# Altium schematic sheet 06-Power_B.SchDoc
size A
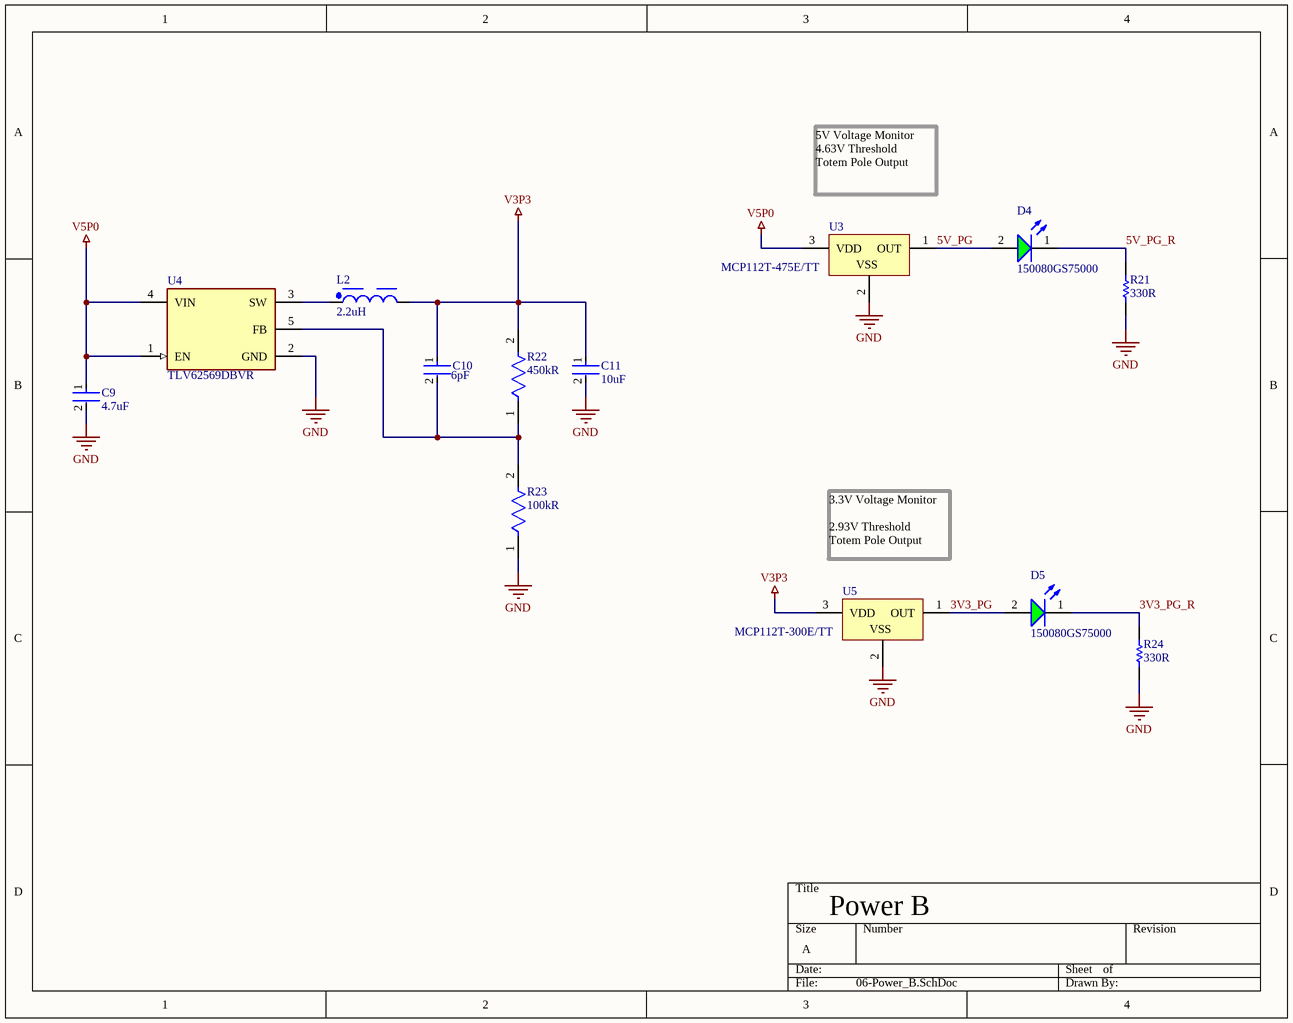
[diagram p0: 06-Power_B.SchDoc]

## Parts
C9  4.7uF  [FP-CC0805-0_85-MFG]
C10  6pF  [FP-CBR08C-MFG]
C11  10uF  [FP-C0805C-DG-MFG]
D4  150080GS75000  [WL-SMCW_0805_150080xx75000]
D5  150080GS75000  [WL-SMCW_0805_150080xx75000]
L2  2.2uH  [WE-TPC_8043]
R21  value 330R  [RESC2013X60X40LL20T25]  (hidden comment: ERA6AEB331V)
R22  450kR  [FP-RT0805-MFG]
R23  100kR  [FP-RMCF0805-IPC_C]
R24  value 330R  [RESC2013X60X40LL20T25]  (hidden comment: ERA6AEB331V)
U3  MCP112T-475E/TT  [SOT-23-TT3_L]
U4  TLV62569DBVR  [FP-DBV0005A-MFG]
U5  MCP112T-300E/TT  [SOT-23-TT3_L]

## Nets
GND: C9.2 C11.2 R21.1 R23.1 R24.1 U3.2(VSS) U4.2(GND) U5.2(VSS)
V3P3: C10.1 C11.1 L2.2 R22.2 U5.3(VDD)
V5P0: C9.1 U3.3(VDD) U4.1(EN) U4.4(VIN)
3V3_PG: D5.2(A) U5.1(OUT)
3V3_PG_R: D5.1(K) R24.2
5V_PG: D4.2(A) U3.1(OUT)
5V_PG_R: D4.1(K) R21.2
NetC10_2: C10.2 R22.1 R23.2 U4.5(FB)
NetL2_1: L2.1 U4.3(SW)

## Notes on the sheet
- 5V Voltage Monitor
  4.63V Threshold
  Totem Pole Output
- 3.3V Voltage Monitor
  2.93V Threshold
  Totem Pole Output
- Power B

## Library data of the parts
C9 = CMP-03422-001026-1: CC0805MKX7R8BB475 / CAP CER 4.7UF 25V X7R 0805; Manufacturer: Yageo; Material: Ceramic; Tolerance: 0.2; Ipc Land Pattern Name: CAPC200125X85; ComponentLink2Description: Datasheet; ComponentLink2URL: http://www.yageo.com/documents/recent/UPY-GPHC_Y5V_6.3V-to-50V_8.pdf; Lead Free: Yes; Mouser Description: Cap Cer 4.7UF 25V X7R 0805; Temperature: -30°C to +85°C; Device Class L3: Ceramic Capacitors; RoHS: TRUE; Height: 0.95mm; Temperature Range Low: -30°C; Device Class L2: Capacitors; Voltage Rating: 25 V; Temperature Characteristic: X7R; Value: 4.7 uF; Category: Cap; Digikey Description: CAP CER 4.7UF 25V X7R 0805; Package: CC0805-0.85; Footprint Url: http://www.yageo.com/exep/pages/download/literatures/UPY-C_GEN_24.pdf; Capacitance: 4.7 uF; Temperature Range High: +85°C; Manufacturer Part Number: CC0805MKX7R8BB475; Device Class L1: Passive Components; Octopart: https://octopart.com/cc0805mkx7r8bb475-yageo-81932647; Automotive: No
C10 = CMP-03020-018446-1: CAP CER 6PF 250V C0G/NP0 0805; Manufacturer Part Number: CBR08C609CAGAC; Manufacturer: KEMET; Temperature Characteristic: C0G; Tolerance: 0.25 pF; Material: Ceramic; Temperature Coefficient: 30ppm/°C; Capacitance: 6.0 pF; Value: 6.0 pF; Lead Free: Yes; Category: Cap; Device Class L3: Ceramic Capacitors; Temperature: -55°C to +125°C; Height: 0.95mm; Package: CBR08C; Temperature Range Low: -55°C; Device Class L1: Passive Components; ComponentLink2Description: Datasheet; ComponentLink2URL: https://content.kemet.com/datasheets/KEM_C1030_CBR_SMD.pdf; Digikey Description: CAP CER 6PF 250V C0G/NP0 0805; Ipc Land Pattern Name: CAPC200125X85; Octopart: https://octopart.com/cbr08c609cagac-kemet-23841672; Device Class L2: Capacitors; Temperature Range High: +125°C; Voltage Rating: 250 V; RoHS: TRUE; Mouser Description: Multilayer Ceramic Capacitors MLCC - SMD/SMT 250volts 6pF C0G 0805 .25pF Tol RF; Automotive: No
C11 = CMP-2007-03243-2: CAP CER 10UF 10V X5R 0805; Manufacturer Part Number: C0805C106K8PACTU; Manufacturer: Kemet; 3DS Part Number: 220-00001; Tolerance: 10%; Temperature Coefficient: 15%; Material: Ceramic; Device Class L2: Capacitors; Device Class L1: Passive Components; ComponentLink2URL: https://content.kemet.com/datasheets/KEM_C1006_X5R_SMD.pdf; Height: 1.4mm; Lead Free: Yes; Digikey Description: CAP CER 10UF 10V X5R 0805; Octopart: https://octopart.com/c0805c106k8pactu-kemet-98697; Capacitance: 10uF; Value: 10uF; Temperature Range Low: -55°C; Temperature: -55°C to +85°C; Automotive: No; Mouser Description: CAP CER 10UF 10V X5R 0805; Ipc Land Pattern Name: CAPC200125X125; Temperature Range High: +85°C; Voltage: 10V; RoHS: TRUE; Device Class L3: Ceramic Capacitors; ComponentLink2Description: Datasheet; Voltage Rating: 10V; Package: C0805C-DG; Temperature Characteristic: X5R; Category: Cap
D4 D5 = CMP-1426-00007-2: LED GREEN CLEAR 0805 SMD; NexarPartId: 29717780; Manufacturer: Wurth Electronics; Wavelength: 520nm; Forward Current: 100mA; Lens Style: Clear, Rectangular; Dominant Wavelength: 525nm; Max Junction Temperature (Tj): 95°C; Power Dissipation: 105mW; Luminous Intensity: 450mcd; Peak Wavelength: 515nm; Viewing Angle: 140°; Test Current: 20mA; Reverse Voltage: 5V; Forward Voltage: 3.2V; Lens Color: Colorless; Lens Size: 1.25mm; Mount: Surface Mount; REACH SVHC: Unknown; Min Operating Temperature: -40°C; Case Code (Imperial): 0805; Case/Package: 0805; Max Operating Temperature: 85°C; RoHS: Compliant; Length: 2mm; Height: 700µm; Width: 1.25mm; Color: Green; Case Code (Metric): 2012; Packaging: Tape and Reel; Max Reverse Voltage (DC): 5V; Supplier: Digikey; Supplier Part Number: 732-4983-1-ND; Manufacturer Part Number: 150080GS75000; Category: LEDs; Stock: 34895; Pricing: 1=0.19, 50=0.176, 100=0.151, 500=0.131 (USD); Mounting Technology: Surface Mount; Package Quantity: 1; Series: WL-SMCW; Lens Transparency: Clear; RoHS Compliant: Yes; Reach SVHC Compliant: Unknown; ComponentLink1URL: https://datasheet.ciiva.com/29563/150080gs75000-29563008.pdf?src-supplier=Digikey; ComponentLink1Description: https://datasheet.ciiva.com/29563/150080gs75000-29563008.pdf?src-supplier=Digikey; ComponentLink2URL: https://datasheet.ciiva.com/29279/759434-da-01-en-chipled-0805-w-kl-gruen-150080gs75000-29279039.pdf?src-supplier=Conrad; ComponentLink2Description: https://datasheet.ciiva.com/29279/759434-da-01-en-chipled-0805-w-kl-gruen-150080gs75000-29279039.pdf?src-supplier=Conrad
L2 = CMP-1479-00021-3: Fixed Ind 2.2UH 5.4A 13 Mohm SMD; NexarPartId: 23392435; Inductance Tolerance: 30%; Self Resonant Frequency: 62MHz; Inductance: 2.2µH; DC Resistance (DCR): 10mΩ; Shielding: Shielded; Series Resistance: 13mΩ; Test Frequency: 100kHz; Saturation Current: 6.3A; Core Material: Ferrite; Packaging: Cut Tape (CT); Width: 8mm; Current Rating: 5.4A; Max Operating Temperature: 125°C; Tolerance: 30%; Number of Pins: 2; Mount: Surface Mount; Termination: SMD/SMT; Min Operating Temperature: -40°C; Lead Free: Lead Free; Ambient Temperature Range High: 85°C; RMS Current (Irms): 5.4A; RoHS: Compliant; Case/Package: Nonstandard; Height: 4.3mm; Composition: Wirewound; REACH SVHC: Unknown; Ambient Temperature Range Low: -40°C; Height - Seated (Max): 4.5974mm; Max DC Current: 5.4A; Length: 8mm
R21 R24 = CMP-2001-00628-1: RES SMD 330 OHM 1% 1/8W 0805; Manufacturer: Panasonic; Manufacturer Part Number: ERJ-6ENF3300V; Voltage Rating: 150V; Power Rating: 125mW; Temperature Coefficient: 100ppm/°C; ComponentLink1URL: https://datasheet.ciiva.com/11808/0900766b80eb1d8c-11808093.pdf?src-supplier=Rs; ComponentLink1Description: https://datasheet.ciiva.com/11808/0900766b80eb1d8c-11808093.pdf?src-supplier=Rs; ComponentLink2URL: https://datasheet.ciiva.com/29184/452857-da-01-en-widerstand-0805-era-29184079.pdf?src-supplier=Conrad; ComponentLink2Description: https://datasheet.ciiva.com/29184/452857-da-01-en-widerstand-0805-era-29184079.pdf?src-supplier=Conrad; ComponentLink3URL: https://datasheet.ciiva.com/9182/aoa0000ce26-9182968.pdf?src-supplier=Avnet; ComponentLink3Description: https://datasheet.ciiva.com/9182/aoa0000ce26-9182968.pdf?src-supplier=Avnet; ComponentLink4URL: https://datasheet.ciiva.com/48536/era-eng-tds-48536857.pdf?src-supplier=Distrelec; ComponentLink4Description: https://datasheet.ciiva.com/48536/era-eng-tds-48536857.pdf?src-supplier=Distrelec; ComponentLink5URL: https://datasheet.ciiva.com/22759/485442-22759176.pdf?src-supplier=Farnell; ComponentLink5Description: https://datasheet.ciiva.com/22759/485442-22759176.pdf?src-supplier=Farnell; ComponentLink6URL: https://datasheet.ciiva.com/6138/485442-6138589.pdf?src-supplier=Farnell; ComponentLink6Description: https://datasheet.ciiva.com/6138/485442-6138589.pdf?src-supplier=Farnell; ComponentLink7URL: https://datasheet.ciiva.com/43457/485442-43457816.pdf?src-supplier=Farnell; ComponentLink7Description: https://datasheet.ciiva.com/43457/485442-43457816.pdf?src-supplier=Farnell; ComponentLink8URL: https://datasheet.ciiva.com/6138/485442-6138585.pdf?src-supplier=Farnell; ComponentLink8Description: https://datasheet.ciiva.com/6138/485442-6138585.pdf?src-supplier=Farnell; ComponentLink9URL: https://datasheet.ciiva.com/24164/aoa0000ce26-197354-24164407.pdf?src-supplier=Mouser; ComponentLink9Description: https://datasheet.ciiva.com/24164/aoa0000ce26-197354-24164407.pdf?src-supplier=Mouser; ComponentLink10URL: https://datasheet.ciiva.com/22744/1776116-22744153.pdf?src-supplier=Element14; ComponentLink10Description: https://datasheet.ciiva.com/22744/1776116-22744153.pdf?src-supplier=Element14; ComponentLink11URL: https://datasheet.ciiva.com/46436/485442-46436606.pdf?src-supplier=Element14; ComponentLink11Description: https://datasheet.ciiva.com/46436/485442-46436606.pdf?src-supplier=Element14; ComponentLink12URL: https://datasheet.ciiva.com/16777/70068849-16777611.pdf?src-supplier=Allied+Electronics; ComponentLink12Description: https://datasheet.ciiva.com/16777/70068849-16777611.pdf?src-supplier=Allied+Electronics; ComponentLink13URL: https://datasheet.ciiva.com/30237/54aoa0000ce26-30237450.pdf?src-supplier=Onlinecomponents.com; ComponentLink13Description: https://datasheet.ciiva.com/30237/54aoa0000ce26-30237450.pdf?src-supplier=Onlinecomponents.com; Supplier: Digikey; Supplier Part Number: P330CCT-ND; RoHS: Yes; Category: Chip SMD Resistors; Stock: 40201; Pricing: 1=0.11, 10=0.053, 50=0.0344, 100=0.0292, 500=0.02058, 1000=0.01792 (USD); Mounting Technology: Surface Mount; Case/Package: 0805; Pins: 2; Case Code (Imperial): 0805; Case Code (Metric): 2012; Contact Plating: Tin; Min Operating Temperature: -55°C; Max Operating Temperature: 155°C; Packaging: Tape and Reel; Tolerance: 1%; Package Quantity: 1; Resistor Type: Thick Film; Number of Terminations: 2; Termination: SMD/SMT; Max Power Dissipation: 125mW; Series: ERJ; Resistance Tolerance: 1%; Technology: THICK FILM; Construction: Rectangular; Voltage Rating (DC): 150V; Features: Automotive AEC-Q200; Length: 2mm; Width: 1.2mm; Height: 0.6mm; Depth: 1.25mm; Reach SVHC Compliant: No; Military Standard: Not; RoHS Compliant: Yes; ComponentLink14URL: https://datasheet.ciiva.com/11821/0900766b80f80784-11821635.pdf?src-supplier=Rs; ComponentLink14Description: https://datasheet.ciiva.com/11821/0900766b80f80784-11821635.pdf?src-supplier=Rs; ComponentLink15URL: https://datasheet.ciiva.com/24025/aoa0000ce2-24025991.pdf?src-supplier=Mouser; ComponentLink15Description: https://datasheet.ciiva.com/24025/aoa0000ce2-24025991.pdf?src-supplier=Mouser
R22 = CMP-03412-016799-1: RES SMD 453K OHM 0.1% 1/8W 0805; Manufacturer Part Number: RT0805BRD07453KL; Manufacturer: Yageo; Value: 453KΩ; Tolerance: 0.0025; Temperature Coefficient: 25 ppm/°C; Voltage Rating: 150V; Power Rating: 0.125W; Footprint Url: http://www.yageo.com/exep/pages/download/literatures/PYu-R_Mount_10.pdf; Temperature: -55°C to +155°C; Digikey Description: RES SMD 453K OHM 0.1% 1/8W 0805; Composition: Thin Film; ComponentLink2Description: Datasheet; Device Class L3: Chip SMD Resistors; Ipc Land Pattern Name: RESC200125X50; RoHS: TRUE; Category: Res; ComponentLink2URL: http://www.yageo.com/documents/recent/PYu-RT_1-to-0.01_RoHS_L_9.pdf; Octopart: https://octopart.com/rt0805brd07453kl-yageo-1444540; Temperature Range High: +155°C; Device Class L1: Passive Components; Automotive: No; Height: 0.6mm; Lead Free: Yes; Resistance: 453KΩ; Temperature Range Low: -55°C; Package: RT0805; Mouser Description: Thin Film Resistors - SMD 1/8W 453K ohm .1% 25ppm; Device Class L2: Resistors; Series: RT
R23 = CMP-26527-001446-1: 100kΩ ±1% 0.125W 0805 Thick Film Chip Resistor AEC-Q200 compliant; Temperature Coefficient: 100ppm/°C; Working Voltage: 150V; Power Rating: 125mW; Resistor Type: Thick Film; Length: 2mm; Depth: 1.25mm; Technology: THICK FILM; Construction: Rectangular; Packaging: Tape and Reel; Contact Plating: Tin; Series: RMCF; Min Operating Temperature: -55°C; Resistance: 100kR; Features: Automotive AEC-Q200; Mount: Surface Mount; Height: 0.026inch; Case Code (Metric): 2012; Case/Package: 0805; Width: 0.049inch; Number of Terminations: 2; Radiation Hardening: No; Max Operating Temperature: 155°C; Lead Free: Lead Free; Military Standard: Not; Max Power Dissipation: 125mW; Case Code (Imperial): 0805; RoHS Compliant: Yes; Tolerance: 1%
U3 = CMP-0130-00073-1: 1.75Î¼A Micropower Voltage Detector, Push-Pull Output, 4.63V, 3-Pin SOT-23, Extended Temperature, Tape and Reel; PackageReference: SOT-23-TT3; DatasheetVersion: revD, Jun-2005; Code_IPC: SOT23-3; PackageDescription: 3-Lead Plastic Small Outline Transistor (TT) [SOT-23]; PackageVersion: revBB, Aug-2009
U4 = CMP-04918-000387-1: IC REG BUCK ADJ 2A SOT23-5; Output Configuration: Positive; Min Output Voltage: 600mV; Max Output Voltage: 5.5V; Switching Frequency: 1.5MHz; Output Type: Adjustable; Synchronous Rectifier: Yes; Min Input Voltage: 2.5V; Output Current: 2A; Mount: Surface Mount; Min Operating Temperature: -40°C; Max Operating Temperature: 125°C; RoHS Compliant: Yes; Max Input Voltage: 5.5V; Case/Package: SOT-23-5; Packaging: Cut Tape
U5 = CMP-0130-00043-1: 1.75Î¼A Micropower Voltage Detector, Push-Pull Output, 2.93V, 3-Pin SOT-23, Extended Temperature, Tape and Reel; Manufacturer 1: Microchip; Max Supply Voltage: 5.5V; Min Supply Voltage: 1V; Number of Voltages Monitored: 1; Operating Supply Current: 1.75uA; Reset: Active Low; Watchdog Timer: No; Max Reset Threshold Voltage: 2.974V; Min Reset Threshold Voltage: 2.886V; Quiescent Current: 1uA; Output: TOTEM-POLE; Code_IPC: SOT23-3; DatasheetVersion: revD, Jun-2005; PackageVersion: revBB, Aug-2009; PackageDescription: 3-Lead Plastic Small Outline Transistor (TT) [SOT-23]; PackageReference: SOT-23-TT3; Supplier 1: Digi-Key; Supplier Part Number 1: MCP112T-300E/TTCT-ND; Manufacturer Part Number 1: MCP112T-300E/TT; RoHS: Yes; Category: Voltage Supervisors; Stock 1: 3000; Pricing 1: 1=0.47000 (USD); Mount: Surface Mount; Case/Package: SOT-23-3; Number of Pins: 3; Min Operating Temperature: -40°C; Max Operating Temperature: 125°C; Package Quantity: 3000; Packaging: Tape and Reel; Type: Simple Reset/Power-On Reset,Voltage Detector; Threshold Voltage: 2.93V; Overvoltage Threshold: 2.974V; Undervoltage Threshold: 2.886V; Nominal Supply Current: 1uA; Max Supply Current: 1.75uA; Supply Current: 1uA; Length: 3.04mm; Width: 1.4mm; Height: 1.02mm; Radiation Hardening: No; Lead Free: Lead Free; RoHS Compliant: Yes; Reach SVHC Compliant: Yes; ComponentLink1URL: https://datasheet.ciiva.com/1170/21889d-1170325.pdf?src-supplier=Element14; ComponentLink1Description: https://datasheet.ciiva.com/1170/21889d-1170325.pdf?src-supplier=Element14; ComponentLink2URL: https://datasheet.ciiva.com/5696/21889d-5696088.pdf?src-supplier=Farnell; ComponentLink2Description: https://datasheet.ciiva.com/5696/21889d-5696088.pdf?src-supplier=Farnell; ComponentLink3URL: https://datasheet.ciiva.com/9215/21889d-9215429.pdf?src-supplier=Avnet; ComponentLink3Description: https://datasheet.ciiva.com/9215/21889d-9215429.pdf?src-supplier=Avnet; ComponentLink4URL: https://datasheet.ciiva.com/16388/filehandler-aspxddocname-en020167-16388517.pdf?src-supplier=Future+Electronics; ComponentLink4Description: https://datasheet.ciiva.com/16388/filehandler-aspxddocname-en020167-16388517.pdf?src-supplier=Future+Electronics; ComponentLink5URL: https://datasheet.ciiva.com/1971/21889d-1971982.pdf?src-supplier=Digi-Key; ComponentLink5Description: https://datasheet.ciiva.com/1971/21889d-1971982.pdf?src-supplier=Digi-Key; ComponentLink6URL: https://datasheet.ciiva.com/1971/21889d-1971983.pdf?src-supplier=Digi-Key; ComponentLink6Description: https://datasheet.ciiva.com/1971/21889d-1971983.pdf?src-supplier=Digi-Key; ComponentLink7URL: https://datasheet.ciiva.com/1971/21889d-1971981.pdf?src-supplier=Digi-Key; ComponentLink7Description: https://datasheet.ciiva.com/1971/21889d-1971981.pdf?src-supplier=Digi-Key; Supplier: Newark; Supplier Part Number: 56J7353; Manufacturer: Microchip; Manufacturer Part Number: MCP112T-300E/TT; Pricing: 3000=0.479 (USD); Mounting Technology: Surface Mount; Pins: 3